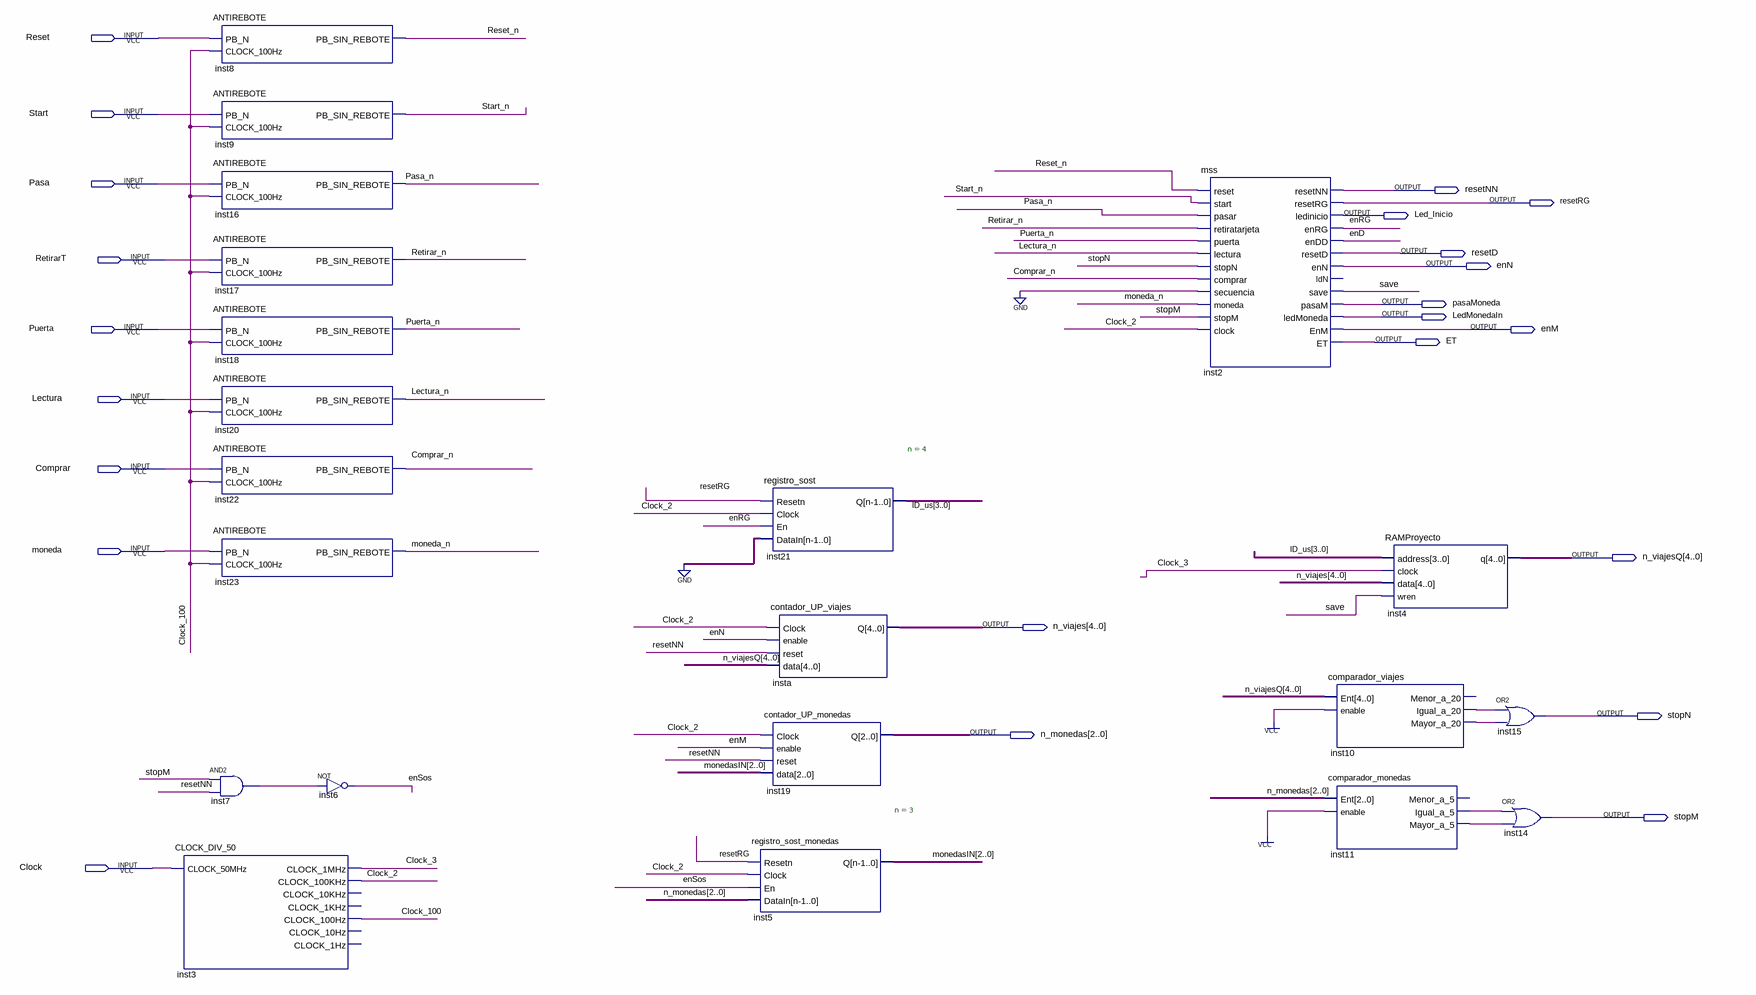
[diagram p0: schematic sheet]
// Quartus schematic SIMULACION.bdf as structural Verilog: 21 symbols, 23 pins
module SIMULACION (
  input  Reset,
  input  Start,
  input  Pasa,
  input  RetirarT,
  input  Puerta,
  input  Lectura,
  input  Comprar,
  input  moneda,
  input  Clock,
  output resetNN,
  output resetRG,
  output Led_Inicio,
  output resetD,
  output enN,
  output pasaMoneda,
  output LedMonedaIn,
  output enM,
  output ET,
  output [4:0] n_viajesQ,
  output [4:0] n_viajes,
  output stopN,
  output [2:0] n_monedas,
  output stopM
);

  wire Clock_2, Clock_3, Clock_100, Comprar_n, enD, enRG, enSos, inst7_out, inst10_igual_a_20,
       inst10_mayor_a_20, inst11_igual_a_5, inst11_mayor_a_5, Lectura_n, moneda_n, Pasa_n, Puerta_n, Reset_n,
       Retirar_n, save, Start_n;
  wire [2:0] monedasIN;
  wire [3:0] ID_us;

  ANTIREBOTE inst8 (.PB_N(Reset), .CLOCK_100Hz(Clock_100), .PB_SIN_REBOTE(Reset_n));
  ANTIREBOTE inst9 (.PB_N(Start), .CLOCK_100Hz(Clock_100), .PB_SIN_REBOTE(Start_n));
  ANTIREBOTE inst16 (.PB_N(Pasa), .CLOCK_100Hz(Clock_100), .PB_SIN_REBOTE(Pasa_n));
  ANTIREBOTE inst17 (.PB_N(RetirarT), .CLOCK_100Hz(Clock_100), .PB_SIN_REBOTE(Retirar_n));
  ANTIREBOTE inst18 (.PB_N(Puerta), .CLOCK_100Hz(Clock_100), .PB_SIN_REBOTE(Puerta_n));
  ANTIREBOTE inst20 (.PB_N(Lectura), .CLOCK_100Hz(Clock_100), .PB_SIN_REBOTE(Lectura_n));
  ANTIREBOTE inst22 (.PB_N(Comprar), .CLOCK_100Hz(Clock_100), .PB_SIN_REBOTE(Comprar_n));
  ANTIREBOTE inst23 (.PB_N(moneda), .CLOCK_100Hz(Clock_100), .PB_SIN_REBOTE(moneda_n));
  and inst7 (inst7_out, stopM, resetNN);
  CLOCK_DIV_50 inst3 (
    .CLOCK_50MHz(Clock), .CLOCK_1MHz(Clock_3), .CLOCK_100KHz(Clock_2), .CLOCK_100Hz(Clock_100));  // open: CLOCK_10KHz, CLOCK_1KHz, CLOCK_10Hz, CLOCK_1Hz
  not inst6 (enSos, inst7_out);
  registro_sost #(.n(4)) inst21 (.Resetn(resetRG), .Clock(Clock_2), .En(enRG), .DataIn(4'b0000), .Q(ID_us));
  contador_UP_viajes insta (.Clock(Clock_2), .enable(enN), .reset(resetNN), .data(n_viajesQ), .Q(n_viajes));
  contador_UP_monedas inst19 (.Clock(Clock_2), .enable(enM), .reset(resetNN), .data(monedasIN), .Q(n_monedas));
  registro_sost_monedas #(.n(3)) inst5 (
    .Resetn(resetRG), .Clock(Clock_2), .En(enSos), .DataIn(n_monedas), .Q(monedasIN));
  mss inst2 (
    .reset(Reset_n), .start(Start_n), .pasar(Pasa_n), .retiratarjeta(Retirar_n), .puerta(Puerta_n),
    .lectura(Lectura_n), .stopN(stopN), .comprar(Comprar_n), .secuencia(1'b0), .moneda(moneda_n),
    .stopM(stopM), .clock(Clock_2), .resetNN(resetNN), .resetRG(resetRG), .ledinicio(Led_Inicio),
    .enRG(enRG), .enDD(enD), .resetD(resetD), .enN(enN), .save(save), .pasaM(pasaMoneda),
    .ledMoneda(LedMonedaIn), .EnM(enM), .ET(ET));  // open: ldN
  comparador_viajes inst10 (
    .Ent(n_viajesQ), .enable(1'b1), .Igual_a_20(inst10_igual_a_20), .Mayor_a_20(inst10_mayor_a_20));  // open: Menor_a_20
  comparador_monedas inst11 (
    .Ent(n_monedas), .enable(1'b1), .Igual_a_5(inst11_igual_a_5), .Mayor_a_5(inst11_mayor_a_5));  // open: Menor_a_5
  RAMProyecto inst4 (.address(ID_us), .clock(Clock_3), .data(n_viajes), .wren(save), .q(n_viajesQ));
  or inst15 (stopN, inst10_igual_a_20, inst10_mayor_a_20);
  or inst14 (stopM, inst11_igual_a_5, inst11_mayor_a_5);
endmodule
